# EAGLE design BT40_v23 (EAGLE 9.6.2)

## Sheet 1 of 2
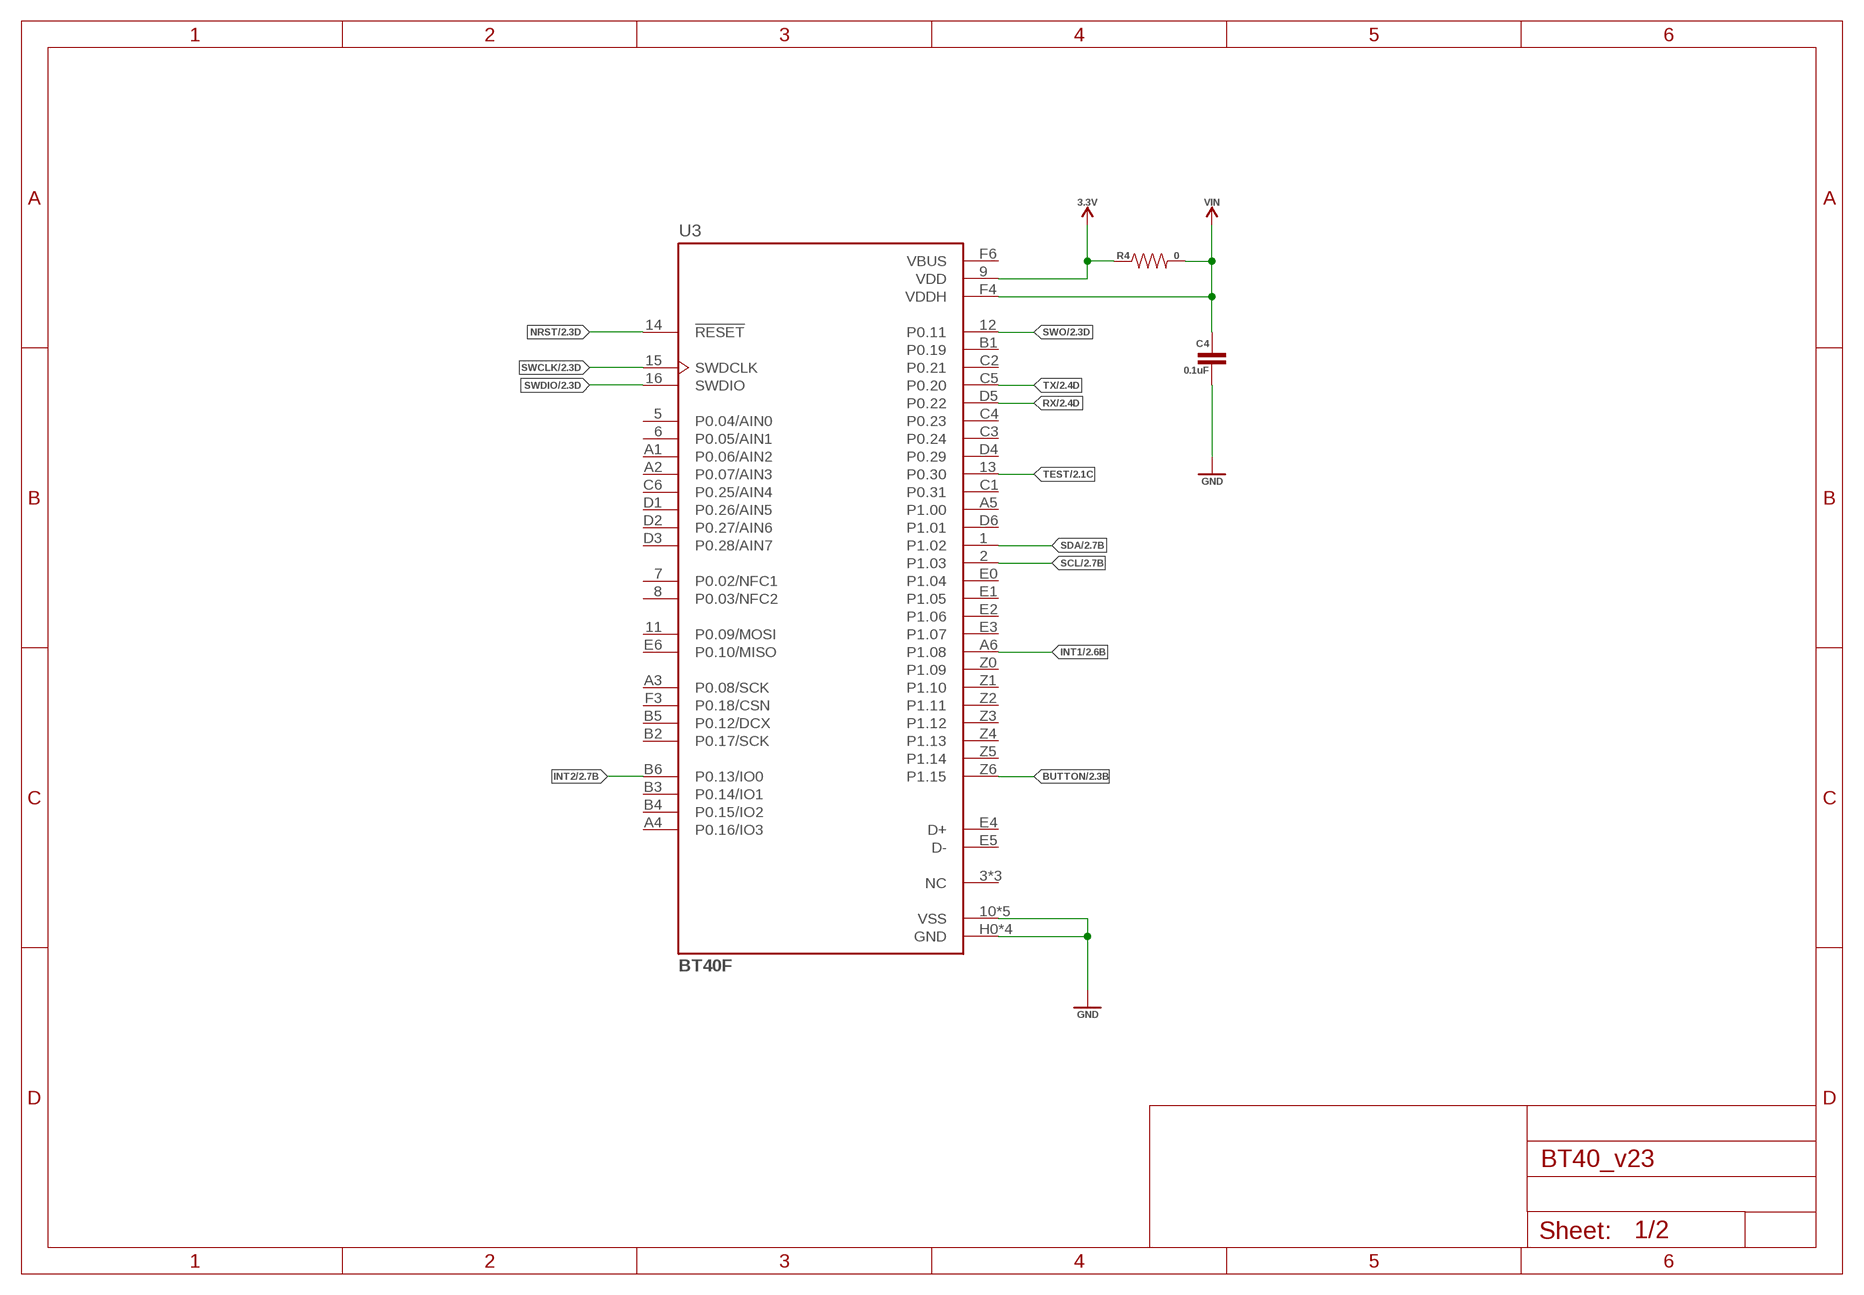
[diagram p0: schematic, sheet 1]

### Parts
C4  0.1uF  0.1UF-0603-25V-(+80/-20%)  [0603]
R4  0  0OHM-0603-1/10W-5%  [0603]
U3  BT40F  [XCVR_BT40F]

### Nets
3.3V: R4.1 U3.9(VDD)
BUTTON: U3.Z6(P1.15) ; also sheet 2
GND: C4.2 U3.10(VSS) U3.A0(VSS) U3.B0(VSS) U3.C0(VSS) U3.D0(VSS) U3.H0(GND) U3.H1(GND) U3.H2(GND) U3.H3(GND) ; also sheet 2
INT1: U3.A6(P1.08) ; also sheet 2
INT2: U3.B6(P0.13/IO0) ; also sheet 2
NRST: U3.14(!RESET) ; also sheet 2
RX: U3.D5(P0.22) ; also sheet 2
SCL: U3.2(P1.03) ; also sheet 2
SDA: U3.1(P1.02) ; also sheet 2
SWCLK: U3.15(SWDCLK) ; also sheet 2
SWDIO: U3.16(SWDIO) ; also sheet 2
SWO: U3.12(P0.11) ; also sheet 2
TEST: U3.13(P0.30) ; also sheet 2
TX: U3.C5(P0.20) ; also sheet 2
VIN: C4.1 R4.2 U3.F4(VDDH) ; also sheet 2
Unconnected: U3.3(NC) U3.4(NC) U3.5(P0.04/AIN0) U3.6(P0.05/AIN1) U3.7(P0.02/NFC1) U3.8(P0.03/NFC2) U3.11(P0.09/MOSI) U3.A1(P0.06/AIN2) U3.A2(P0.07/AIN3) U3.A3(P0.08/SCK) U3.A4(P0.16/IO3) U3.A5(P1.00) U3.B1(P0.19) U3.B2(P0.17/SCK) U3.B3(P0.14/IO1) U3.B4(P0.15/IO2) U3.B5(P0.12/DCX) U3.C1(P0.31) U3.C2(P0.21) U3.C3(P0.24) U3.C4(P0.23) U3.C6(P0.25/AIN4) U3.D1(P0.26/AIN5) U3.D2(P0.27/AIN6) U3.D3(P0.28/AIN7) U3.D4(P0.29) U3.D6(P1.01) U3.E0(P1.04) U3.E1(P1.05) U3.E2(P1.06) U3.E3(P1.07) U3.E4(D+) U3.E5(D-) U3.E6(P0.10/MISO) U3.F3(P0.18/CSN) U3.F5(NC) U3.Z0(P1.09) U3.Z1(P1.10) U3.Z2(P1.11) U3.Z3(P1.12) U3.Z4(P1.13) U3.Z5(P1.14)

## Sheet 2 of 2
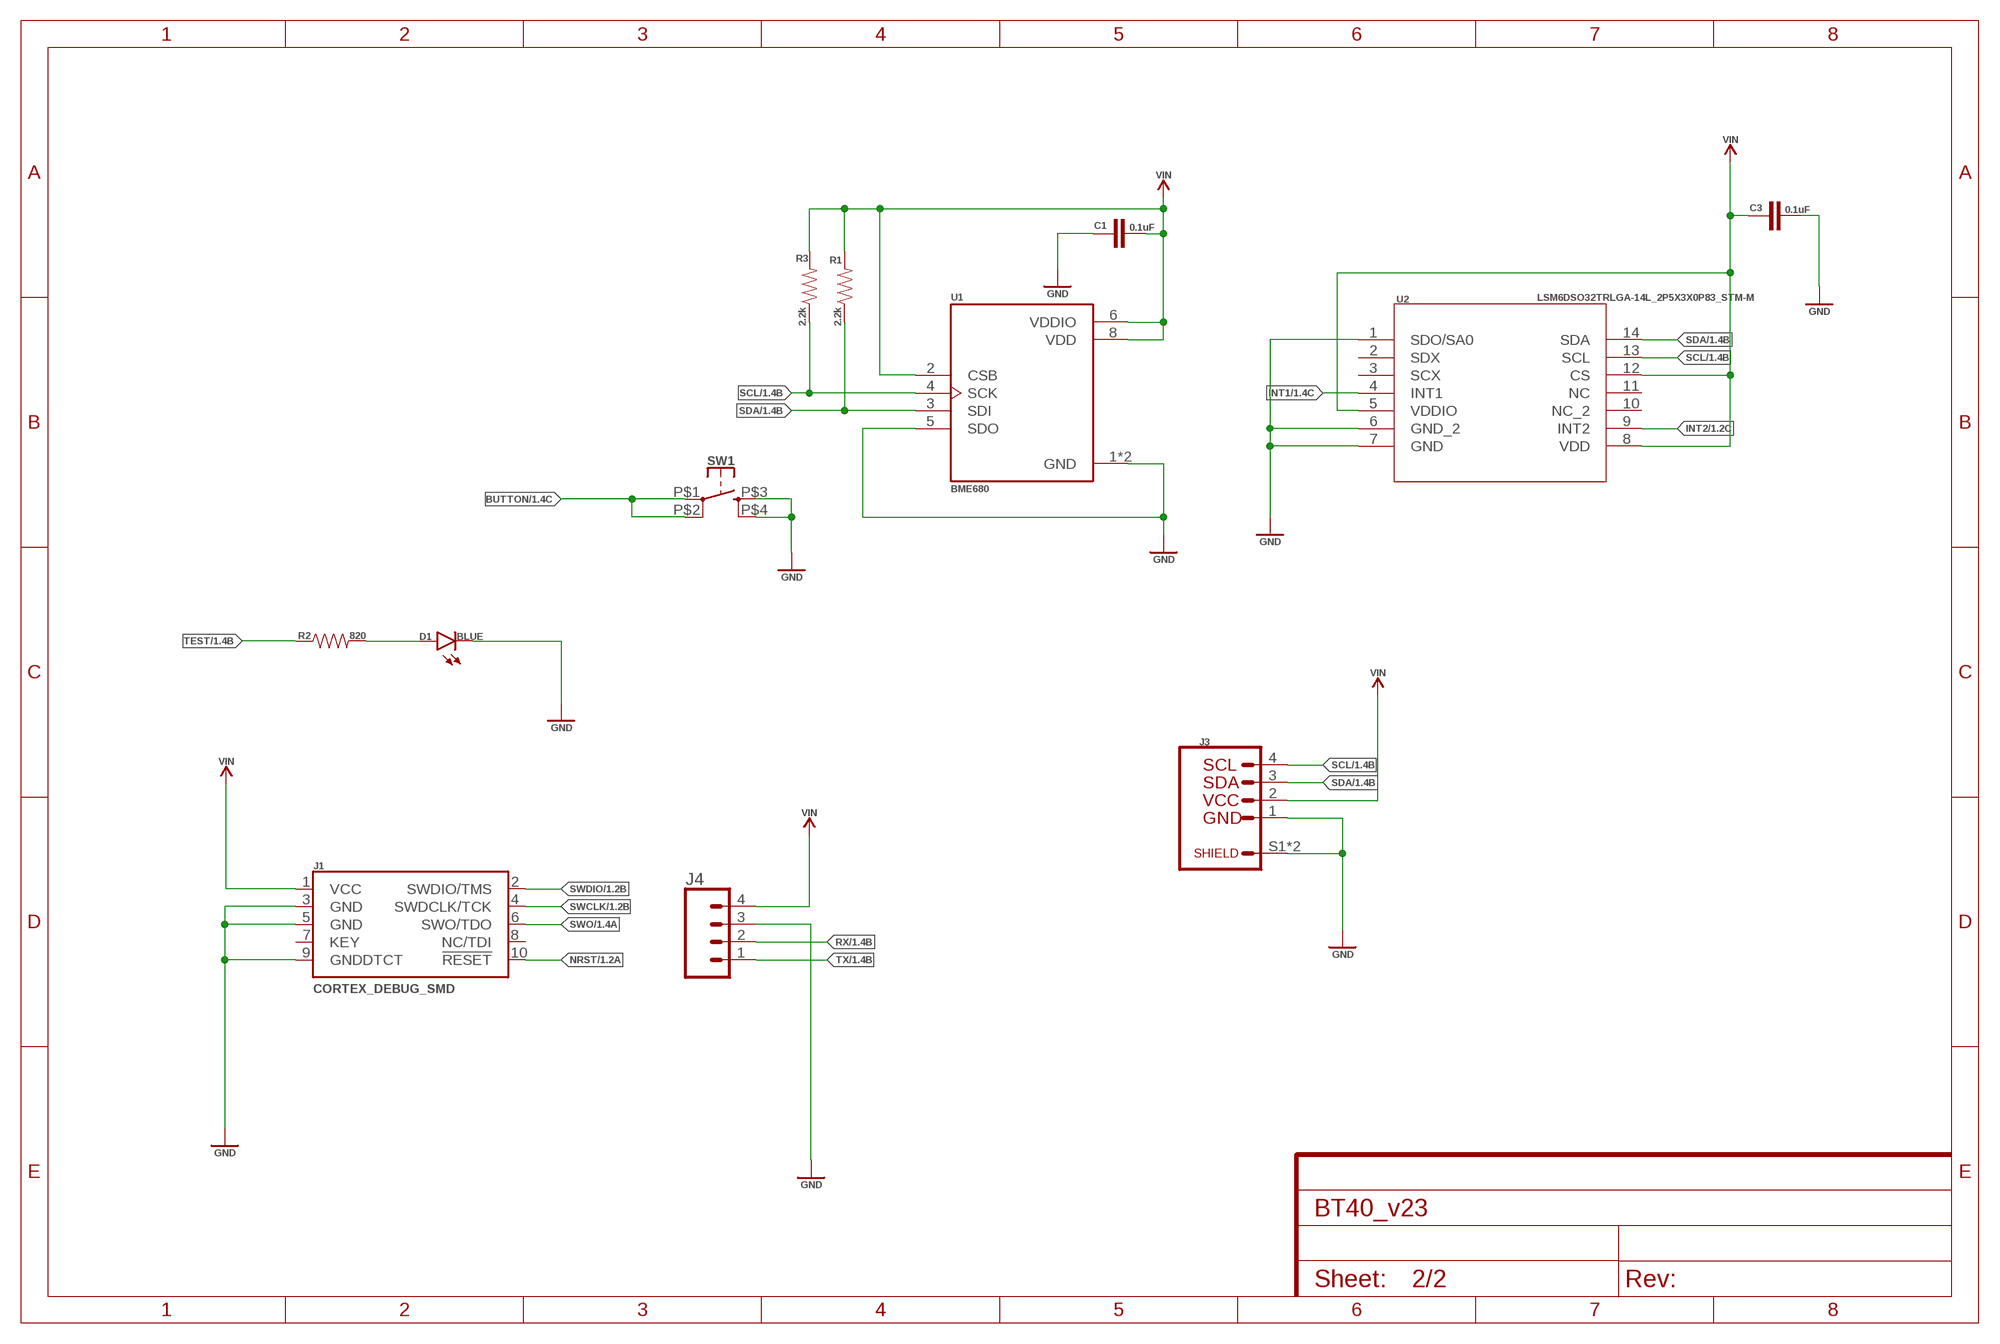
[diagram p1: schematic, sheet 2]

### Parts
C1  0.1uF  0.1UF-0603-25V-(+80/-20%)  [0603]
C3  0.1uF  0.1UF-0603-25V-(+80/-20%)  [0603]
D1  BLUE  LED-BLUE0603  [LED-0603]
J1  CORTEX_DEBUG_SMD  [SAMTECH_FTSH-105-01]
J3  QWIIC  [CONN_BM04B-SRSS-TB(LF)(SN)]
J4  CONN_04SMD  [1X04_SMD_RA_MALE]
R1  2.2k  2.2KOHM-0603-1/10W-1%  [0603]
R2  820  8.2KOHM-0603-1/10W-5%  [0603]
R3  2.2k  2.2KOHM-0603-1/10W-1%  [0603]
SW1  REVERSE_SWITCH  [REVERSE_TACTILE]
U1  BME680  [PSON80P300X300X100-8N]
U2  LSM6DSO32TRLGA-14L_2P5X3X0P83_STM-M  [LGA-14L_2P5X3X0P83_STM-M]

### Nets
BUTTON: SW1.P$1 SW1.P$2 ; also sheet 1
GND: C1.1 C3.2 D1.C J1.3(GND) J1.5(GND) J1.9(GNDDTCT) J3.1 J3.S1 J3.S2 J4.3(SDA) SW1.P$3 SW1.P$4 U1.1(GND) U1.5(SDO) U1.7(GND) U2.1(SDO/SA0) U2.6(GND_2) U2.7(GND) ; also sheet 1
INT1: U2.4(INT1) ; also sheet 1
INT2: U2.9(INT2) ; also sheet 1
N$1: D1.A R2.2
NRST: J1.10(!RESET) ; also sheet 1
RX: J4.2(SCL) ; also sheet 1
SCL: J3.4 R3.1 U1.4(SCK) U2.13(SCL) ; also sheet 1
SDA: J3.3 R1.1 U1.3(SDI) U2.14(SDA) ; also sheet 1
SWCLK: J1.4(SWDCLK/TCK) ; also sheet 1
SWDIO: J1.2(SWDIO/TMS) ; also sheet 1
SWO: J1.6(SWO/TDO) ; also sheet 1
TEST: R2.1 ; also sheet 1
TX: J4.1(VCC) ; also sheet 1
VIN: C1.2 C3.1 J1.1(VCC) J3.2 J4.4(GND) R1.2 R3.2 U1.2(CSB) U1.6(VDDIO) U1.8(VDD) U2.5(VDDIO) U2.8(VDD) U2.12(CS) ; also sheet 1
Unconnected: J1.7(KEY) J1.8(NC/TDI) U2.2(SDX) U2.3(SCX) U2.10(NC_2) U2.11(NC)

## Power pins joined to a net without a drawn wire
VBUS: U3.F6(VBUS)

## Library data of the parts
C1 C3 C4 = SparkFun-Capacitors:0.1UF: 0.1µF ceramic capacitors A capacitor is a passive two-terminal electrical component used to store electrical energy temporarily in an electric field.; PROD_ID: CAP-00810
D1 = SparkFun-LED:LED-BLUE: Blue SMD LED Used in manufacturing of various products at SparkFun Packages: 0603 - SMD 0603 package [Product Link] <http://www.digikey.com/product-detail/en/SMLE12BC7TT86/511-1589-2-ND/1641808> 1206 - SMD1206 package [Product Link] <http://www.digikey.com/product-detail/en/lite-on-inc/LTST-C150TBKT/160-1643-1-ND/573584> SparkFun Products: ESP8266 Thing-Dev Board <https://www.sparkfun.com/products/13711> RedBoard <https://www.sparkfun.com/products/12757>; PROD_ID: DIO-08575
J1 = SparkFun-Connectors:CORTEX_DEBUG: Cortex Debug Connector - 10 pin Supports JTAG debug, Serial Wire debug, and Serial Wire Viewer. PTH and SMD connector options available. General Connector Information <http://infocenter.arm.com/help/topic/com.arm.doc.faqs/attached/13634/cortex_debug_connectors.pdf> Products: PTH Connector <http://www.digikey.com/product-detail/en/cnc-tech/3220-10-0100-00/1175-1627-ND/3883661> -via Digi-Key SparkFun PSoc <https://www.sparkfun.com/products/13229> SparkFun T <https://www.sparkfun.com/products/13810>
J3 = BM04B-SRSS-TB_LF__SN_:QWIIC
J4 = SparkFun-Connectors:CONN_04: Multi connection point. Often used as Generic Header-pin footprint for 0.1 inch spaced/style header connections On any of the 0.1 inch spaced packages, you can populate with these: Break Away Headers - Straight <https://www.sparkfun.com/products/116> (PRT-00116) Break Away Male Headers - Right Angle <https://www.sparkfun.com/products/553> (PRT-00553) Female Headers <https://www.sparkfun.com/products/115> (PRT-00115) Break Away Headers - Machine Pin <https://www.sparkfun.com/products/117> (PRT-00117) Break Away Female Headers - Swiss Machine Pin <https://www.sparkfun.com/products/743> (PRT-00743) For SCREWTERMINALS and SPRING TERMINALS visit here: Screw Terimnals on SparkFun.com <https://www.sparkfun.com/search/results?term=Screw+Terminals> (5mm/3.5mm/2.54mm spacing) This device is also useful as a general connection point to wire up your design to another part of your project. Our various solder wires solder well into these plated through hole pads. Hook-Up Wire - Assortment (Stranded, 22 AWG) <https://www.sparkfun.com/products/11375> (PRT-11375) Hook-Up Wire - Assortment (Solid Core, 22 AWG) <https://www.sparkfun.com/products/11367> (PRT-11367) View the entire wire category on our website here <https://www.sparkfun.com/categories/141> Special notes: Molex polarized connector foot print use with SKU : PRT-08231 with associated crimp pins and housings. 1MM SMD Version SKU: PRT-10208; PROD_ID: CONN-09140; SF_ID: PRT-12638
R1 R3 = SparkFun-Resistors:2.2KOHM: 2.2kΩ resistor A resistor is a passive two-terminal electrical component that implements electrical resistance as a circuit element. Resistors act to reduce current flow, and, at the same time, act to lower voltage levels within circuits. - Wikipedia; PROD_ID: RES-08272
R2 = SparkFun-Resistors:8.2KOHM: 8.2kΩ resistor A resistor is a passive two-terminal electrical component that implements electrical resistance as a circuit element. Resistors act to reduce current flow, and, at the same time, act to lower voltage levels within circuits. - Wikipedia; PROD_ID: RES-10646; SPICEPREFIX: R; VALUE: 8.2k
R4 = SparkFun-Resistors:0OHM: 0Ω resistor A resistor is a passive two-terminal electrical component that implements electrical resistance as a circuit element. Resistors act to reduce current flow, and, at the same time, act to lower voltage levels within circuits. - Wikipedia; PROD_ID: RES-08609
SW1 = reverse_mount_sw:REVERSE_SWITCH
U1 = BME680:BME680: Integrated Environmental Unit Check availability <https://pricing.snapeda.com/parts/BME680/Bosch%20Sensortec/view-part?ref=eda>; AVAILABILITY: In Stock; DESCRIPTION: Gas, Humidity, Pressure, Temperature Sensor I²C, SPI Output; MF: Bosch Sensortec; MP: BME680; PACKAGE: LGA-8 Bosch Tools; PRICE: None; PURCHASE-URL: https://pricing.snapeda.com/search/part/BME680/?ref=eda
U2 = LSM6DSO32:LSM6DSO32TR; COPYRIGHT: Copyright (C) 2022 Ultra Librarian. All rights reserved.; MANUFACTURER_PART_NUMBER: LSM6DSO32TR; MFR_NAME: STMicroelectronics
U3 = BT40F:BT40F: Check availability <https://pricing.snapeda.com/parts/BT40F/Fanstel%20Corp./view-part?ref=eda>; AVAILABILITY: In Stock; DESCRIPTION: 802.15.4, Bluetooth Bluetooth v5.1, Zigbee® Transceiver Module 2.4GHz PCB Trace Surface Mount; MF: Fanstel Corp.; MP: BT40F; PACKAGE: SMD-66 Fanstel Corp.; PRICE: None; PURCHASE-URL: https://pricing.snapeda.com/search/part/BT40F/?ref=eda

## Board
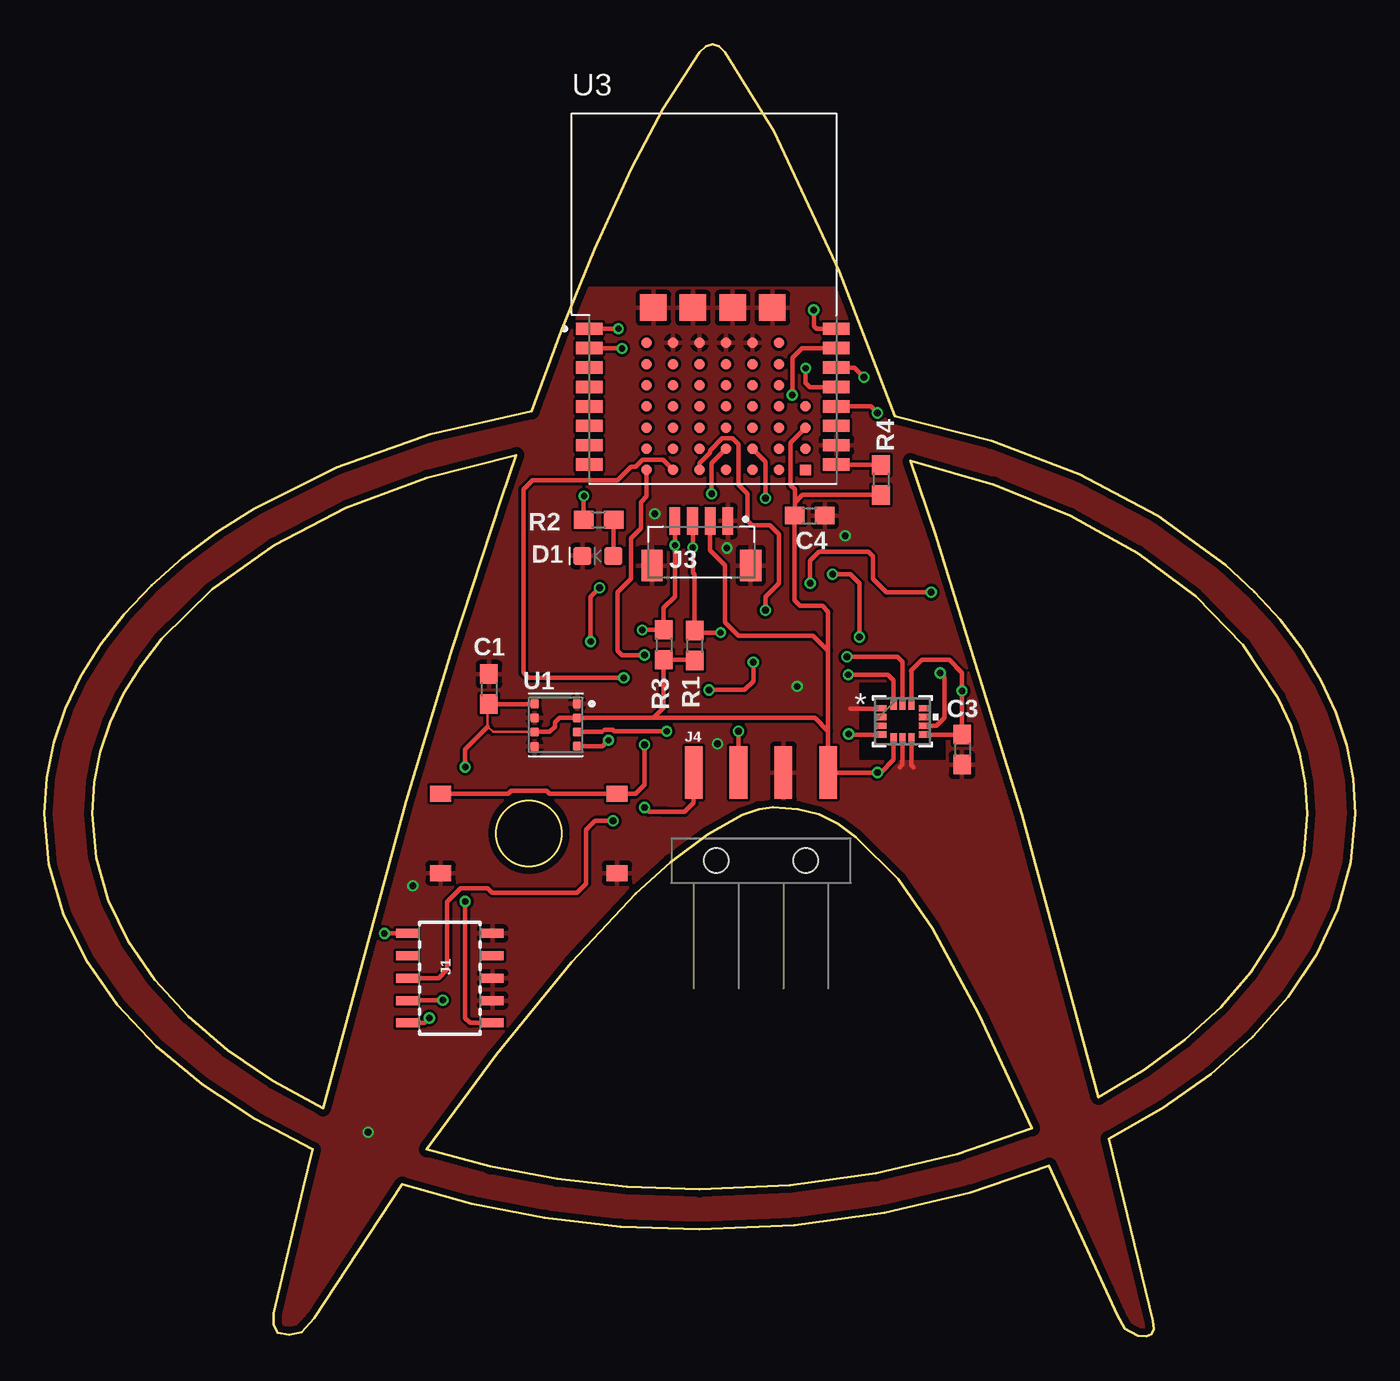
[diagram p2: board, top side]
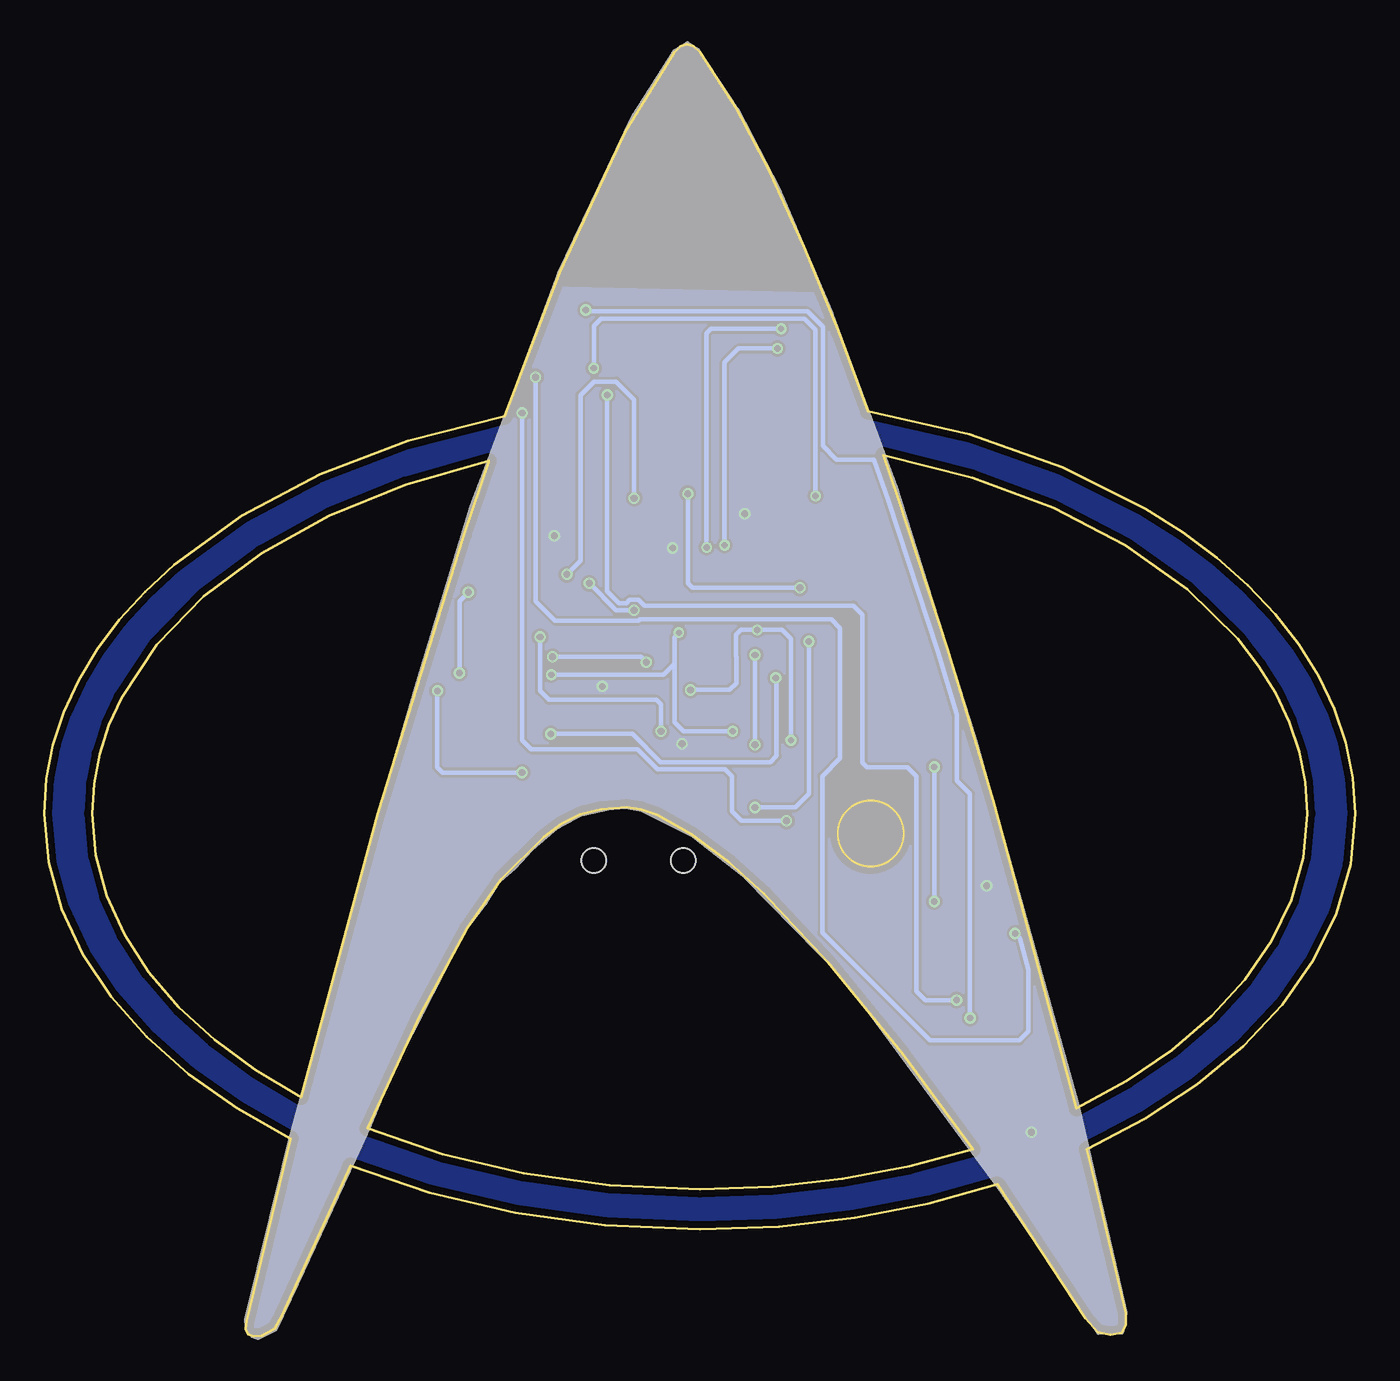
[diagram p3: board, bottom side, seen from below]

Size 74.35 x 73.25 mm. Coordinates in mm from the lower left corner, seen from the top.
Outline: 50.38,23.13 53,18.26 56.01,11.8 51.76,10.34 47.17,9.25 42.29,8.57 37.17,8.34 33.06,8.49 29.09,8.93 25.29,9.64 21.69,10.61 25.67,16 29.9,21.2 33.53,25.1 35.51,26.88 37.65,28.47 39.61,29.57 40.52,29.89 41.33,30.01 42.74,29.9 43.93,29.59 45,29.06 46.04,28.29 48.45,25.92 50.38,23.13
Outline: 49.13,49.62 53.87,48.28 58.18,46.52 62.02,44.4 65.3,41.94 67.97,39.2 69.95,36.21 70.67,34.63 71.2,33.01 71.51,31.34 71.62,29.64 71.41,27.26 70.79,24.97 69.79,22.76 68.42,20.66 66.71,18.67 64.69,16.82 62.37,15.11 59.78,13.56 55.44,29.59 50.54,45.46 49.13,49.62
Outline: 15.82,12.93 12.97,14.49 10.41,16.24 8.17,18.15 6.28,20.21 4.77,22.41 3.65,24.72 2.96,27.14 2.73,29.64 2.84,31.41 3.19,33.13 3.75,34.82 4.52,36.45 5.49,38.02 6.66,39.53 9.52,42.34 13.03,44.84 17.13,46.96 21.73,48.68 26.76,49.95 25.93,47.55 23.12,38.98 20.52,30.35 15.82,12.93
Outline: 29.32,56.97 27.64,52.43 21.88,51.13 16.61,49.28 11.9,46.93 9.79,45.58 7.85,44.13 6.1,42.58 4.55,40.95 3.21,39.23 2.08,37.43 1.19,35.57 0.54,33.65 0.14,31.67 0,29.64 0.28,26.75 1.08,23.97 2.39,21.31 4.15,18.8 6.36,16.45 8.96,14.29 11.93,12.34 15.23,10.61 14.68,8.39 13.02,1.33 13.02,0.66 13.23,0.22 13.91,0.11 14.61,0.24 15.32,1.04 20.31,8.62 24.23,7.53 28.36,6.73 32.69,6.23 37.17,6.06 42.53,6.31 47.66,7.01 52.49,8.15 56.98,9.69 60.85,1.2 61.28,0.45 62.02,0.03 62.5,0 62.79,0.12 62.91,0.4 62.87,0.88 60.37,11.21 63.41,12.94 66.15,14.87 68.54,16.98 70.55,19.25 72.17,21.67 73.36,24.22 74.1,26.88 74.35,29.64 74.22,31.6 73.85,33.52 73.23,35.39 72.4,37.2 71.34,38.94 70.08,40.62 68.61,42.22 66.97,43.74 63.15,46.5 58.7,48.86 53.7,50.76 48.24,52.15 45.08,60.34 41.38,68.32 38.6,72.79 38.26,73.13 37.89,73.25 37.52,73.13 37.17,72.79 35.1,69.59 33.31,66.2 31.21,61.63 29.32,56.97
Copper layers (1*16): Top 0.035559375mm / dielectric 1.6mm / Bottom 0.035559375mm
Design rules "oshpark-2layer": minimum track width 6mil, minimum drill 10mil, track to track 6mil, track to pad 6mil, pad to pad 6mil, via to via 6mil, smd to smd 6mil, copper to edge 15mil, drill to drill 6mil, minimum pad ring 5mil, minimum via ring 5mil, stop-mask expansion 2.5mil, vias tented up to drill 0mil, thermal gap 10mil

### Footprints (pad centres in the part's own frame; a part is rotated, then mirrored left to right if it is on the bottom)
0603 = smd 1.1 x 1: 1 -0.85,0; 2 0.85,0
LED-0603 = smd 1 x 1: A -0.877,0; C 0.877,0
SAMTECH_FTSH-105-01 = smd 0.508 x 1.27: 1 -2.54,-2.413; 2 -2.54,2.413; 3 -1.27,-2.413; 4 -1.27,2.413; 5 0,-2.413; 6 0,2.413; 7 1.27,-2.413; 8 1.27,2.413; 9 2.54,-2.413; 10 2.54,2.413
CONN_BM04B-SRSS-TB(LF)(SN) = smd 0.6 x 1.55: 1 -1.5,-1.325; 2 -0.5,-1.325; 3 0.5,-1.325; 4 1.5,-1.325 | smd 1.2 x 1.8: S1 -2.8,1.2; S2 2.8,1.2
1X04_SMD_RA_MALE = smd 1 x 3: 1 -3.81,5; 2 -1.27,5; 3 1.27,5; 4 3.81,5 | hole 1.4: -2.54,0; 2.54,0
REVERSE_TACTILE = smd 1.2 x 0.9: P$1 -5,2.25; P$2 5,2.25; P$3 5,-2.25; P$4 -5,-2.25
PSON80P300X300X100-8N = smd 0.5 x 0.5: 1 1.2,1.2; 2 1.2,0.4; 3 1.2,-0.4; 4 1.2,-1.2; 5 -1.2,-1.22; 6 -1.2,-0.4; 7 -1.2,0.4; 8 -1.2,1.2
LGA-14L_2P5X3X0P83_STM-M = smd 0.577 x 0.352: 1 -1.21,0.75; 2 -1.21,0.25; 3 -1.21,-0.25; 4 -1.21,-0.75; 8 1.21,-0.75; 9 1.21,-0.25; 10 1.21,0.25; 11 1.21,0.75 | smd 0.352 x 0.577: 5 -0.5,-0.956; 6 0,-0.956; 7 0.5,-0.956; 12 0.5,0.956; 13 0,0.956; 14 -0.5,0.956
XCVR_BT40F = smd 1.5 x 0.7: 1 -6.5,-1.7; 2 -6.5,-2.8; 3 -6.5,-3.9; 4 -6.5,-5; 5 -6.5,-6.1; 6 -6.5,-7.2; 7 -6.5,-8.3; 8 -6.5,-9.4; 9 7.5,-9.4; 10 7.5,-8.3; 11 7.5,-7.2; 12 7.5,-6.1; 13 7.5,-5; 14 7.5,-3.9; 15 7.5,-2.8; 16 7.5,-1.7 | smd 0.6 x 0.6: A0 -1.75,-2.5; A1 -1.75,-3.7; A2 -1.75,-4.9; A3 -1.75,-6.1; A4 -1.75,-7.3; A5 -1.75,-8.5; A6 -1.75,-9.7; B0 -0.25,-2.5; B1 -0.25,-3.7; B2 -0.25,-4.9; B3 -0.25,-6.1; B4 -0.25,-7.3; B5 -0.25,-8.5; B6 -0.25,-9.7; C0 1.25,-2.5; C1 1.25,-3.7; C2 1.25,-4.9; C3 1.25,-6.1; C4 1.25,-7.3; C5 1.25,-8.5; C6 1.25,-9.7; D0 2.75,-2.5; D1 2.75,-3.7; D2 2.75,-4.9; D3 2.75,-6.1; D4 2.75,-7.3; D5 2.75,-8.5; D6 2.75,-9.7; E0 4.25,-2.5; E1 4.25,-3.7; E2 4.25,-4.9; E3 4.25,-6.1; E4 4.25,-7.3; E5 4.25,-8.5; E6 4.25,-9.7; F3 5.75,-6.1; F4 5.75,-7.3; F5 5.75,-8.5; F6 5.75,-9.7; Z0 -3.25,-2.5; Z1 -3.25,-3.7; Z2 -3.25,-4.9; Z3 -3.25,-6.1; Z4 -3.25,-7.3; Z5 -3.25,-8.5; Z6 -3.25,-9.7 | smd 1.5 x 1.5: H0 -2.875,-0.5; H1 -0.625,-0.5; H2 1.625,-0.5; H3 3.875,-0.5

### Placement (x,y rotation side)
C1  25.22,36.69 270 top
C3  52.05,33.26 270 top
C4  43.41,46.52 0 top
D1  31.4,44.24 180 top
J1  23.01,20.31 90 top
J3  37.26,44.9 180 top
J4  40.64,26.96 0 top
R1  36.88,39.16 270 top
R2  31.45,46.29 0 top
R3  35.13,39.21 270 top
R4  47.45,48.55 270 top
SW1  27.48,28.51 0 top
U1  29.01,34.66 0 top
U2  48.67,34.86 0 top
U3  37.42,58.82 0 top

### Tracks (layer width: path | path; a pad name or v marks a point on that pad's centre or on a via)
3.3V
  Top 0.254: U3.9 47.44,49.42 R4.1
BUTTON  (via drill 0.38)
  Top 0.254: SW1.P$1 26.31,30.76 26.48,30.94 28.49,30.94 28.66,30.76 SW1.P$2 33.54,30.76 34.04,31.26 v34.04,33.54 | v34.04,38.62 32.77,38.62 32.51,38.88 32.51,42.18 33.28,42.94 33.28,45.25 33.83,45.81 33.83,47.28 34.17,47.62 U3.Z6
  Bottom 0.254: v34.04,33.54 v34.04,38.62
GND  (via drill 0.38)
  Top 0.254: U2.7 49.17,32.38 49.28,32.27 | U2.1 47.42,35.58 45.72,35.58 | U2.6 48.67,32.43 48.52,32.27
  other vias: 38.71,44.69 34.62,46.62 18.37,11.57 20.91,25.54 45.42,45.38 42.7,36.85 38.18,33.59
  pour Top: 0.26,-3.29 0.26,59.43 72.96,59.43 84.08,9.41 32.01,-21.07
  pour Bottom: -1.73,6.41 -1.73,58.41 87.15,60.36 67.96,-0.1 19.31,-10.91
INT1  (via drill 0.38)
  Top 0.254: U2.4 45.66,34.11 v45.62,34.15 | v32.87,37.33 27.46,37.33 27.18,37.61 27.18,48.02 27.69,48.53 32.51,48.53 33.28,49.29 33.52,49.29 33.93,49.7 35.09,49.7 U3.A6
  Bottom 0.254: v45.62,34.15 41,34.15 39.4,32.55 33.17,32.55 32.82,32.91 32.82,37.28 v32.87,37.33
INT2  (via drill 0.38)
  Top 0.254: U2.9 50.6,34.61 51.06,35.07 51.06,37.35 v50.8,37.61 | v43.44,42.69 43.44,43.96 43.94,44.47 46.74,44.47 46.99,44.21 46.99,42.94 47.75,42.18 v50.29,42.18 | v40.9,41.16 40.9,41.93 41.66,42.69 41.66,45.48 41.15,45.99 40.13,45.99 39.88,46.24 39.88,47.77 39.37,48.28 39.37,50.56 39.04,50.9 38.43,50.9 37.75,50.22 37.75,50.08 37.17,49.5 U3.B6
  Bottom 0.254: v50.8,37.61 50.8,41.67 v50.29,42.18 | v43.44,42.69 41.91,41.16 v40.9,41.16
N$1
  Top 0.254: D1.A 32.27,46.27 R2.2
NRST  (via drill 0.38)
  Top 0.254: U3.14 45.94,54.92 v46.48,54.37 | v19.3,22.85 J1.10
  Bottom 0.254: v46.48,54.37 46.48,41.67 45.38,40.57 40.65,40.57 40.56,40.66 29.72,40.66 29.21,40.15 29.21,32.78 30.23,31.77 30.23,22.88 24.13,16.78 19.05,16.78 18.54,17.29 18.54,20.78 19.03,22.57 v19.3,22.85
RX  (via drill 0.38)
  Top 0.254: J4.2 v39.37,34.31 | v46.23,39.64 46.23,42.69 45.72,43.2 v44.71,43.2 | U3.D5 40.9,49.59 v40.9,47.51
  Bottom 0.254: v39.37,34.31 39.37,35.83 39.63,36.08 45.72,36.08 46.23,36.59 v46.23,39.64 | v44.71,43.2 43.94,43.96 43.94,53.36 43.18,54.12 41.91,54.12 40.9,53.1 v40.9,47.51
SCL  (via drill 0.35, 0.38)
  Top 0.254: J3.4 v35.76,44.85 35.76,41.93 35.13,41.29 R3.1 33.92,40.06 v33.91,40.05 | v32.77,56 30.94,56 U3.2 | U1.4 31.67,33.46 v32.01,33.8 | U2.13 48.67,37.35 48.67,37.38 48.67,38.24 48.39,38.52 v45.52,38.52 | v40.21,38.22 40.21,37.15 39.7,36.64 v37.7,36.64
  Bottom 0.254: v35.76,44.85 35.76,55.21 34.98,56 v32.77,56 | v32.01,33.8 32.01,39.54 32.51,40.05 v33.91,40.05 34.85,40.05 35.13,39.77 35.13,38.55 35.1,38.52 35.1,37.02 35.49,36.64 v37.7,36.64 | v45.52,38.52 40.51,38.52 v40.21,38.22
SDA  (via drill 0.35)
  Top 0.254: J3.3 36.78,46.2 v36.78,44.72 36.78,43.3 36.88,43.2 R1.1 37,39.89 v38.36,39.89 | v32.56,57.11 U3.1 | U1.3 31.65,34.26 31.76,34.38 32.25,34.38 32.32,34.31 v35.31,34.31 | U2.14 48.17,37.19 47.86,37.51 v45.59,37.51
  Bottom 0.254: v36.78,44.72 36.78,56.86 36.53,57.11 v32.56,57.11 | v35.31,34.31 38.1,34.31 38.61,34.81 38.61,38.12 | 38.61,38.12 38.61,39.64 v38.36,39.89 | v45.59,37.51 39.22,37.51 38.61,38.12
SWCLK  (via drill 0.38)
  Top 0.254: U3.15 42.96,56.02 42.42,55.48 v42.42,53.36 | v22.61,19.07 20.63,19.07 J1.4
  Bottom 0.254: v22.61,19.07 24.39,19.07 24.89,19.57 24.89,31.77 25.4,32.27 27.69,32.27 27.94,32.53 27.94,40.91 28.45,41.42 40.31,41.42 40.65,41.76 41.14,41.76 41.33,41.57 41.74,41.57 42.42,42.25 v42.42,53.36
SWDIO  (via drill 0.38)
  Top 0.254: J1.2 21.57,17.77 v21.85,18.05 | v43.64,58.18 43.64,57.27 43.79,57.11 U3.16
  Bottom 0.254: v21.85,18.05 21.85,30.75 22.61,31.51 22.61,35.24 23.68,38.8 26.48,47.36 27.29,49.7 28.68,49.7 29.41,49.7 30.2,50.49 30.2,57.23 31.07,58.1 43.56,58.1 v43.64,58.18
SWO  (via drill 0.38)
  Top 0.254: U3.12 46.87,52.72 v47.25,52.34 | v32.26,29.23 31.24,29.23 30.74,28.72 30.74,25.67 30.23,25.16 25.4,25.16 25.15,25.42 23.62,25.42 22.86,24.65 22.86,20.82 22.35,20.31 J1.6
  Bottom 0.254: v47.25,52.34 47.25,33.8 46.74,33.29 40.71,33.29 39.57,32.15 35.74,32.15 35.33,31.74 35.33,29.76 34.8,29.23 v32.26,29.23
TEST  (via drill 0.35)
  Top 0.254: R2.1 30.6,47.63 v30.61,47.64 | v43.18,54.88 43.18,54.04 43.41,53.81 U3.13
  Bottom 0.254: v43.18,54.88 43.18,57.29 42.78,57.7 31.24,57.7 30.61,57.06 v30.61,47.64
TX  (via drill 0.38)
  Top 0.254: J4.1 36.83,30.24 36.32,29.73 35.31,29.73 35.05,29.73 34.29,29.73 v34.04,29.99 | v30.99,39.39 30.99,41.93 v31.5,42.43 | v37.85,47.77 37.85,49.5 U3.C5
  Bottom 0.254: v34.04,29.99 31.75,29.99 30.99,30.75 v30.99,39.39 | v31.5,42.43 37.59,42.43 37.85,42.69 v37.85,47.77
VIN  (via drill 0.38)
  Top 0.152: U1.6 25.45,34.26 25.15,34.56 25.15,35.77 C1.2
  Top 0.254: 44.45,34.31 J4.4 v47.25,31.96 47.44,31.96 48.17,32.69 U2.5 | 44.45,34.31 44.45,38.88 | 44.45,38.88 44.45,41.09 44.12,41.42 42.85,41.42 42.55,41.72 42.55,46.51 C4.1 42.56,47.26 | 42.56,47.26 42.56,48.01 42.32,48.25 42.32,50.67 U3.F4 | U2.12 49.17,37.72 49.15,37.73 49.76,38.34 51.33,38.34 52.05,37.63 v52.05,36.59 C3.1 U2.8 | 44.45,38.88 43.6,39.73 39.37,39.73 38.61,40.49 38.61,43.7 37.76,44.55 J3.2 | 34.55,35.06 U1.2 29.21,35.07 28.96,34.81 28.96,34.56 28.66,34.26 U1.6 | 34.55,35.06 43.7,35.06 44.45,34.31 | U1.8 27.79,35.84 C1.2 | R1.2 36.83,38.36 R3.2 35.13,35.65 34.55,35.06 | J1.1 24.16,17.77 23.88,18.05 v23.88,24.65 | v23.88,32.27 23.88,33.29 25.15,34.56 | R4.2 43.01,47.7 42.56,47.26
  Bottom 0.254: v47.25,31.96 51.76,31.96 52.07,32.27 52.07,36.59 v52.05,36.59 | v23.88,32.27 v23.88,24.65